# Altium project AUSB.PrjPcb
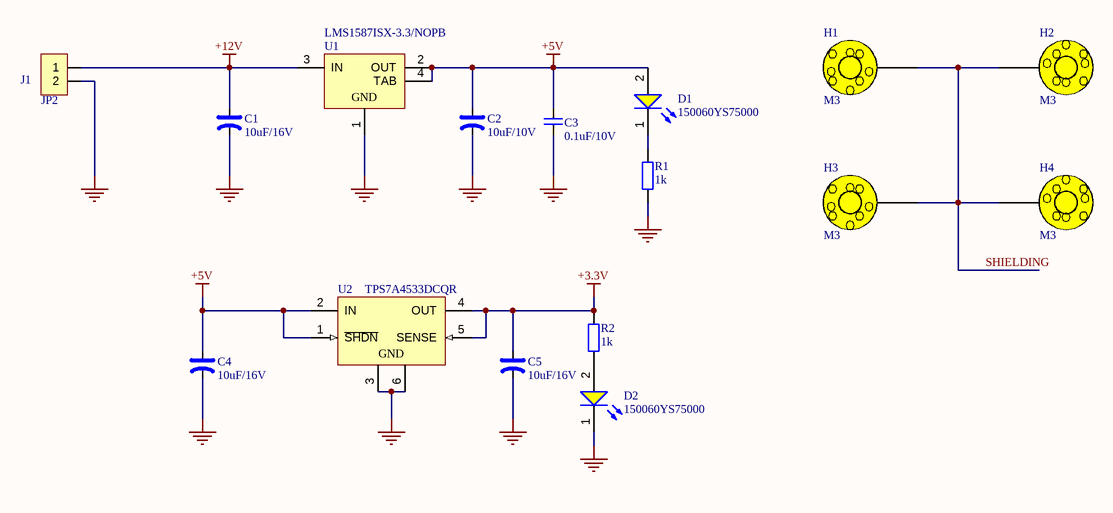
[diagram p0: POWER.SchDoc]
SubSystem: USB board; Revision: 1.0.0; MasterProject: BEEE; DrawnBy: cd; Date: 02/26/2026; CheckedBy: David; ApprovedBy: David
3 sheets, 71 parts. Net scope: global (net labels, ports and power ports of the same name join across sheets).
Board file: AUSB_PCB.PcbDoc
Sheets:
  POWER.SchDoc
  MCU.SchDoc
  AVR.SchDoc

## Sheet POWER.SchDoc
size 420 x 297 mm; SheetNumber: 4; SheetTotal: 7

### Parts
C1  10uF/16V  [CAP_MP_2012X170]
C2  10uF/10V  [CAP_MP_2012X170]
C3  0.1uF/10V  [CAP_C_1608X80]
C4  10uF/16V  [CAP_MP_2012X170]
C5  10uF/16V  [CAP_MP_2012X170]
D1  150060YS75000  [WL-SMCW_0603_150060xx75000]
D2  150060YS75000  [WL-SMCW_0603_150060xx75000]
H1  M3  [HEX-M3]
H2  M3  [HEX-M3]
H3  M3  [HEX-M3]
H4  M3  [HEX-M3]
J1  JP2  [JP2-D1T]
R1  1k  [RES_C_1608X60]
R2  1k  [RES_C_1608X60]
U1  LMS1587ISX-3.3/NOPB  [TS3B_L]
U2  TPS7A4533DCQR  [DCQ0006A_M]

### Nets
+3.3V: C5.1 R2.2 U2.4(OUT) U2.5(SENSE)
+5V: C2.1 C3.1 C4.1 D1.2(A) U1.2(OUT) U1.4(TAB) U2.1(~{SHDN}) U2.2(IN)  [project net NTC1+]
+12V: C1.1 J1.1 U1.3(IN)
GND: C1.2 C2.2 C3.2 C4.2 C5.2 D2.1(K) J1.2 R1.2 U1.1(GND) U2.3(GND) U2.6(GND)
SHIELDING: H1.1 H2.1 H3.1 H4.1
NetD1_1: D1.1(K) R1.1
NetD2_2: D2.2(A) R2.1

### Notes on the sheet
- Sub-system:
- Project:
- Design by:
- Sheet title:
- Sheet
- of
- Checked by:
- Approved by:
- Doc No:
- Revision:
- Size:
- Date:
- A3

### Library data of the parts
C1 C2 C4 C5 = CAP_TH: CAP_Polarization; Published: 8-Jun-2000; LatestRevisionDate: 17-Jul-2002; LatestRevisionNote: Re-released for DXP Platform.; PackageReference: POLAR0.8; Publisher: Altium Limited
C3 = CAP_SMD: CAP_Chip; Value: 33pF
D1 D2 = CMP-1426-00005-2: LED YELLOW CLEAR 0603 SMD; NexarPartId: 29687085; Wavelength: 590nm; Luminous Intensity: 120mcd; Peak Wavelength: 595nm; Forward Current: 100mA; Power Dissipation: 72mW; Forward Voltage: 2V; Test Current: 20mA; Reverse Voltage: 5V; Lens Style: Clear, Rectangular; Max Junction Temperature (Tj): 95°C; Viewing Angle: 140°; Case Code (Imperial): 0603; Height: 700µm; REACH SVHC: Unknown; Dominant Wavelength: 590nm; Min Operating Temperature: -40°C; Color: Yellow; Width: 800µm; Mount: Surface Mount; Packaging: Tape and Reel; Max Operating Temperature: 85°C; RoHS: Compliant; Max Reverse Voltage (DC): 5V; Case Code (Metric): 1608; Length: 1.6mm; Case/Package: 0603
H1-H4 = HEX-M3
J1 = JP2: WR-PHD 2.54 mm Angled Socket Header; Manufacturer: W¨¹rth Elektronik eiSos GmbH; partNo: 613002143121; ComponentLink1 Description: Manufacturer; ComponentLink2 Description: Datasheet; NoPins: 02; Created Date: 29 March 2013; ComponentLink1URL: http://www.we-online.com; ComponentLink2URL: http://katalog.we-online.de/em/datasheet/6130xx143121.pdf; Created by: Karrer Zheng
R1 R2 = Tro 0603 1% 10k: RES; Chung_Loai: Dán; Don_Vi: Con; So_Chan: 2; Ten_Linh_Kien: Trở 0603 1% 10k; Ma_Hang: MH006333; Kieu_Chan: *
U1 = CMP-0062-00180-3: 3A Low Dropout Fast Response Regulators, 3-pin TO-263, Pb-Free; Manufacturer: National Semiconductor; PowerWise: N; High-Reliability: Y; PackageTopMarking: NSUZXYTTE#*LMS1587*IS-3.3; CompType: LDO IC; ComponentLink1Description: Manufacturer URL; PackageReference: TS3B; ComponentLink1URL: http://www.national.com/; ComponentLink2URL: http://www.national.com/ds/LM/LMS1587.pdf; DatasheetVersion: Jun-2005; ComponentLink3URL: http://www.national.com/pf/LM/LMS1587.html; PartNumber: LMS1587ISX-3.3/NOPB; RevisionNote: SCH symbol layout adjusted; PinCount: 3; RoHS: Y; Code_JEDEC: MO-169-AA; PackageDescription: TO-263, Molded, .400 x .390 x .180in, 3 Lead, .1in Pitch, Surface Mount; ComponentLink4Description: TS3B Package Page; ComponentLink3Description: LMS1587 Web Page; PackageVersion: revF, Apr-2005; ComponentLink2Description: LMS1587 Datasheet; ComponentLink4URL: http://www.national.com/packaging/folders/ts3b.html
U2 = CMP-0395-00360-2: Single Output Fast Transient Response LDO, 1.5 A, Fixed 3.3 V Output, 2.1 to 20 V Input, 6-pin SOT-223 (DCQ), -40 to 125 degC, Green (RoHS & no Sb/Br); Manufacturer: Texas Instruments; Vout Adj(Max)(V): 3.3; Vin(Max)(V): 20; Accuracy(%): 1; SubFamily: Single Channel LDO; Vin(Min)(V): 2.1; Iout(Max)(A): 1.5; Vdo(Typ)(mV): 300; Eco-Plan: Green (RoHS & no Sb/Br); Mounting Technology: Surface Mount; PackageDescription: 6-Pin Plastic Small Outline, Body 3.5 x 6.5 mm, Pitch 1.27 mm; ComponentLink2URL: http://www.ti.com/general/docs/lit/getliterature.tsp?genericPartNumber=TPS7A4533&fileType=pdf; PackageReference: DCQ0006A; ComponentLink3Description: Package Specification; ComponentLink2Description: Datasheet; Fixed Output Options(V): 3.3; Iq(Typ)(mA): 1; ComponentLink1URL: http://www.ti.com/; PartNumber: TPS7A4533DCQR; ComponentLink1Description: Manufacturer URL; PackageVersion: 4202109/D; Vout Adj(Min)(V): 3.3; DatasheetVersion: SLVS720D; ComponentLink3URL: http://www.ti.com/litv/pdf/mpds098c

## Sheet MCU.SchDoc
size 420 x 297 mm; SheetNumber: 5; SheetTotal: 7
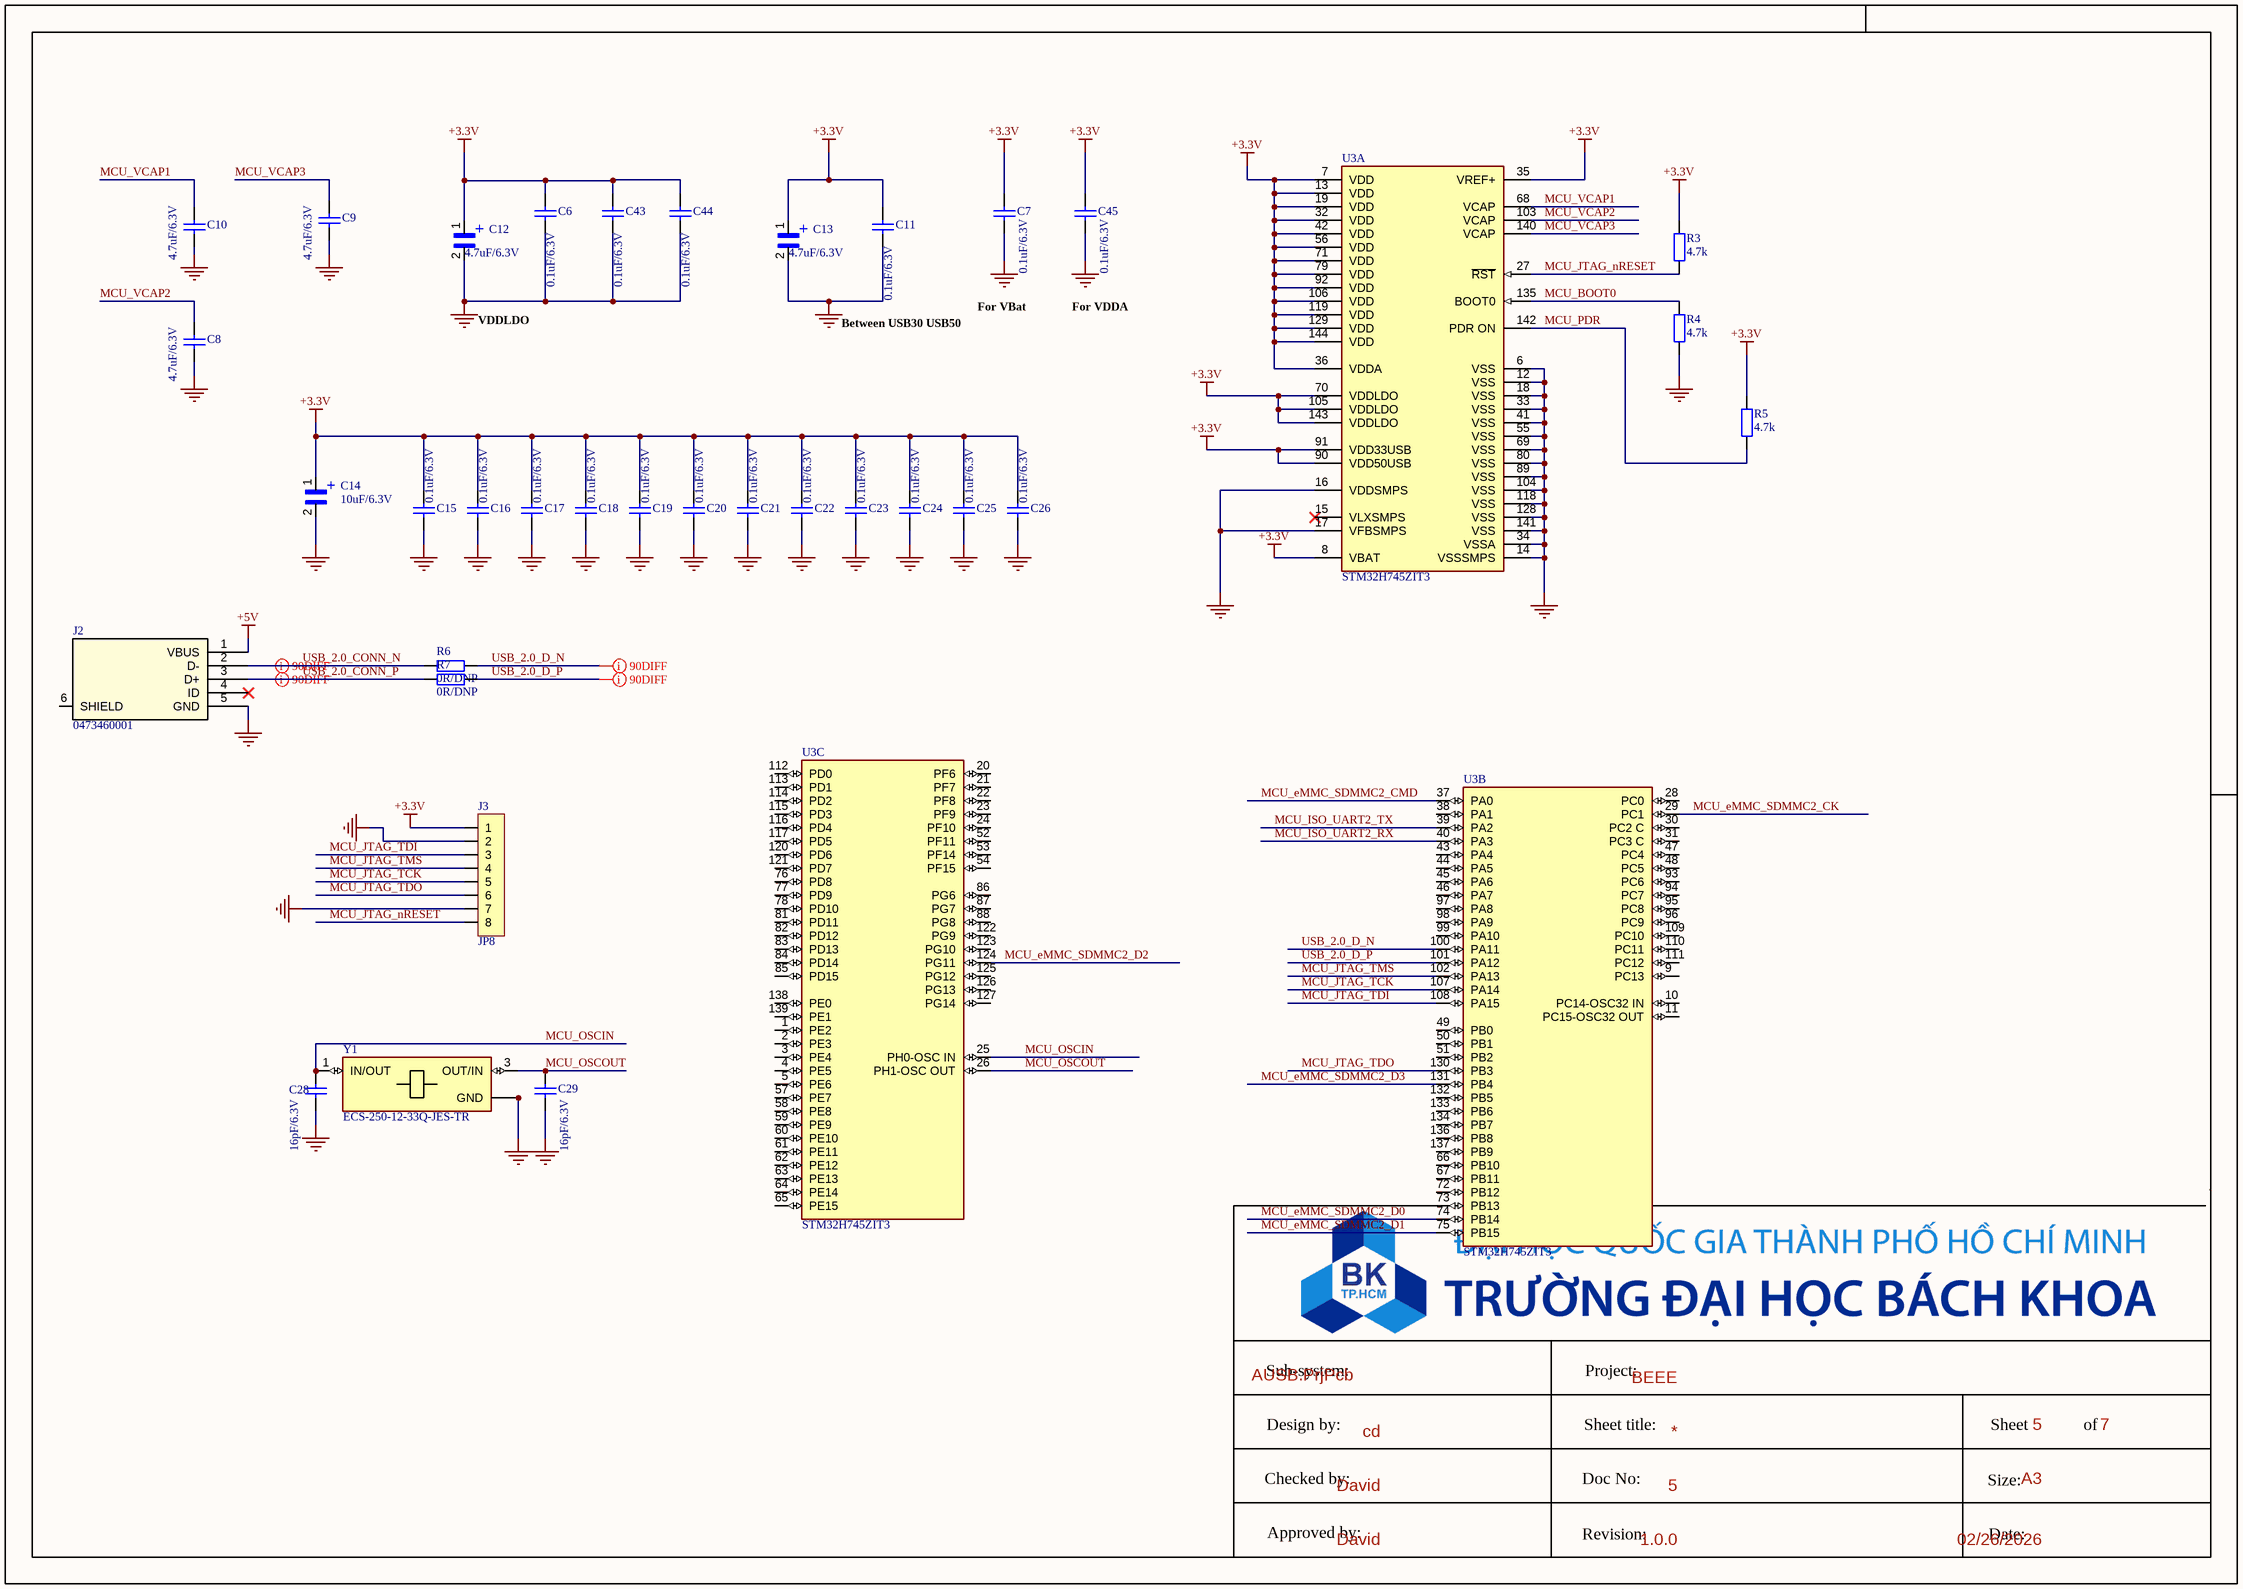
[diagram p1: MCU.SchDoc]

### Parts
C6  0.1uF/6.3V  [CAP_C_1608X80]
C7  0.1uF/6.3V  [CAP_C_1608X80]
C8  4.7uF/6.3V  [CAP_C_1608X80]
C9  4.7uF/6.3V  [CAP_C_1608X80]
C10  4.7uF/6.3V  [CAP_C_1608X80]
C11  0.1uF/6.3V  [CAP_C_1608X80]
C12  4.7uF/6.3V  [CAP_MP_1608X90]
C13  4.7uF/6.3V  [CAP_MP_1608X90]
C14  10uF/6.3V  [CAP_MP_2012X170]
C15  0.1uF/6.3V  [CAP_C_1608X80]
C16  0.1uF/6.3V  [CAP_C_1608X80]
C17  0.1uF/6.3V  [CAP_C_1608X80]
C18  0.1uF/6.3V  [CAP_C_1608X80]
C19  0.1uF/6.3V  [CAP_C_1608X80]
C20  0.1uF/6.3V  [CAP_C_1608X80]
C21  0.1uF/6.3V  [CAP_C_1608X80]
C22  0.1uF/6.3V  [CAP_C_1608X80]
C23  0.1uF/6.3V  [CAP_C_1608X80]
C24  0.1uF/6.3V  [CAP_C_1608X80]
C25  0.1uF/6.3V  [CAP_C_1608X80]
C26  0.1uF/6.3V  [CAP_C_1608X80]
C28  16pF/6.3V  [CAP_C_1608X80]
C29  16pF/6.3V  [CAP_C_1608X80]
C43  0.1uF/6.3V  [CAP_C_1608X80]
C44  0.1uF/6.3V  [CAP_C_1608X80]
C45  0.1uF/6.3V  [CAP_C_1608X80]
J2  0473460001  [47346-0001_MOL]
J3  JP8  [JP8-C1T]
R3  4.7k  [RES_C_1608X60]
R4  4.7k  [RES_C_1608X60]
R5  4.7k  [RES_C_1608X60]
R6  0R/DNP  [RES_C_1608X60]
R7  0R/DNP  [RES_C_1608X60]
U3  STM32H745ZIT3  [FP-LQFP144-1A-MFG]  (parts A,B,C of 3)
Y1  ECS-250-12-33Q-JES-TR  [XTAL_ECS-250-12-33Q-JES-TR]

### Nets
+3.3V: C6.1 C7.1 C11.1 C12.1 C13.1 C14.1 C15.1 C16.1 C17.1 C18.1 C19.1 C20.1 C21.1 C22.1 C23.1 C24.1 C25.1 C26.1 C43.1 C44.1 C45.1 J3.1 R3.1 R5.1 U3.7(VDD) U3.8(VBAT) U3.13(VDD) U3.19(VDD) U3.32(VDD) U3.35(VREF+) U3.36(VDDA) U3.42(VDD) U3.56(VDD) U3.70(VDDLDO) U3.71(VDD) U3.79(VDD) U3.90(VDD50USB) U3.91(VDD33USB) U3.92(VDD) U3.105(VDDLDO) U3.106(VDD) U3.119(VDD) U3.129(VDD) U3.143(VDDLDO) U3.144(VDD)
+5V: J2.1(VBUS)  [project net NTC1+]
GND: C6.2 C7.2 C8.2 C9.2 C10.2 C11.2 C12.2 C13.2 C14.2 C15.2 C16.2 C17.2 C18.2 C19.2 C20.2 C21.2 C22.2 C23.2 C24.2 C25.2 C26.2 C28.1 C29.1 C43.2 C44.2 C45.2 J2.5(GND) J3.2 J3.7 R4.1 U3.6(VSS) U3.12(VSS) U3.14(VSSSMPS) U3.16(VDDSMPS) U3.17(VFBSMPS) U3.18(VSS) U3.33(VSS) U3.34(VSSA) U3.41(VSS) U3.55(VSS) U3.69(VSS) U3.80(VSS) U3.89(VSS) U3.104(VSS) U3.118(VSS) U3.128(VSS) U3.141(VSS) Y1.2(GND) Y1.4(GND)
MCU_BOOT0: R4.2 U3.135(BOOT0)
MCU_eMMC_SDMMC2_CK: U3.29(PC1)
MCU_eMMC_SDMMC2_CMD: U3.37(PA0)
MCU_eMMC_SDMMC2_D0: U3.74(PB14)
MCU_eMMC_SDMMC2_D1: U3.75(PB15)
MCU_eMMC_SDMMC2_D2: U3.124(PG11)
MCU_eMMC_SDMMC2_D3: U3.131(PB4)
MCU_ISO_UART2_RX: U3.40(PA3)
MCU_ISO_UART2_TX: U3.39(PA2)
MCU_JTAG_nRESET: J3.8 R3.2 U3.27(~{RST})
MCU_JTAG_TCK: J3.5 U3.107(PA14)
MCU_JTAG_TDI: J3.3 U3.108(PA15)
MCU_JTAG_TDO: J3.6 U3.130(PB3)
MCU_JTAG_TMS: J3.4 U3.102(PA13)
MCU_OSCIN: C28.2 U3.25(PH0-OSC_IN) Y1.1(IN/OUT)
MCU_OSCOUT: C29.2 U3.26(PH1-OSC_OUT) Y1.3(OUT/IN)
MCU_PDR: R5.2 U3.142(PDR_ON)
MCU_VCAP1: C10.1 U3.68(VCAP)
MCU_VCAP2: C8.1 U3.103(VCAP)
MCU_VCAP3: C9.1 U3.140(VCAP)
USB_2.0_CONN_N: J2.2(D-) R6.1
USB_2.0_CONN_P: J2.3(D+) R7.1
USB_2.0_D_N: R6.2 U3.100(PA11)
USB_2.0_D_P: R7.2 U3.101(PA12)

Not connected (* = marked no-connect by the designer): J2 4(ID)* 6(SHIELD); U3 1(PE2) 2(PE3) 3(PE4) 4(PE5) 5(PE6) 9(PC13) 10(PC14-OSC32_IN) 11(PC15-OSC32_OUT) 15(VLXSMPS)* 20(PF6) 21(PF7) 22(PF8) 23(PF9) 24(PF10) 28(PC0) 30(PC2_C) 31(PC3_C) 38(PA1) 43(PA4) 44(PA5) 45(PA6) 46(PA7) 47(PC4) 48(PC5) 49(PB0) 50(PB1) 51(PB2) 52(PF11) 53(PF14) 54(PF15) 57(PE7) 58(PE8) 59(PE9) 60(PE10) 61(PE11) 62(PE12) 63(PE13) 64(PE14) 65(PE15) 66(PB10) 67(PB11) 72(PB12) 73(PB13) 76(PD8) 77(PD9) 78(PD10) 81(PD11) 82(PD12) 83(PD13) 84(PD14) 85(PD15) 86(PG6) 87(PG7) 88(PG8) 93(PC6) 94(PC7) 95(PC8) 96(PC9) 97(PA8) 98(PA9) 99(PA10) 109(PC10) 110(PC11) 111(PC12) 112(PD0) 113(PD1) 114(PD2) 115(PD3) 116(PD4) 117(PD5) 120(PD6) 121(PD7) 122(PG9) 123(PG10) 125(PG12) 126(PG13) 127(PG14) 132(PB5) 133(PB6) 134(PB7) 136(PB8) 137(PB9) 138(PE0) 139(PE1)

### Layout directives
differential pair; differential pair class DIFF90: USB_2.0_CONN_N, USB_2.0_CONN_P, USB_2.0_D_N, USB_2.0_D_P

### Notes on the sheet
- VDDLDO
- Between USB30 USB50
- For VBat
- For VDDA
- Sub-system:
- Project:
- Design by:
- Sheet title:
- Sheet
- of
- Checked by:
- Approved by:
- Doc No:
- Revision:
- Size:
- Date:
- A3
- (in symbol TACL335M003RTA) +
- (in symbol TACR686M003RTA) +

### Library data of the parts
C6 C8-C10 C43 C44 = Tu 0402 33nF 10V: 4.7 µF ±20% 6.3V Ceramic Capacitor X7T 0402 (1005 Metric): GRT155D70J475ME13J; Chung_Loai: Dán; Don_Vi: Con; So_Chan: 2; Ten_Linh_Kien: Tụ 0402 33nF X7R 10V GRM155R71A333KA01D; Ma_Hang: MH007853; Kieu_Chan: *
C7 C11 C15-C26 C28 C29 C45 = Tu 0402 33nF 10V: CAPC; Chung_Loai: Dán; Don_Vi: Con; So_Chan: 2; Ten_Linh_Kien: Tụ 0402 33nF X7R 10V GRM155R71A333KA01D; Ma_Hang: MH007853; Kieu_Chan: *
C12 C13 = TACL335M003RTA: CAPP; Package: None; Price: None; Value: *; MP: TACL335M003RTA; Availability: Unavailable
C14 = TACR686M003RTA: CAPP; MF: AVX; Availability: Unavailable; SnapEDA_Link: https://www.snapeda.com/parts/TACR686M003RTA/AVX/view-part/1745975/?ref=snap; MP: TACR686M003RTA; Value: *; Price: None; Package: 0805 AVX
J2 = USB_micro: No Description Available; Mfr_Name: Molex Connector Corporation; RefDes: RefDes; Type: Type
R3-R5 = Tro 0603 1% 10k: as R1 on sheet POWER; Kieu_Chan: *
R6 R7 = Tro 0603 1% 1k: RES SMD 12K OHM 1% 1/10W 0603, P/N: ERJ-3EKF1202V; Chung_Loai: Dán; So_Chan: 2; Don_Vi: Con; Ten_Linh_Kien: Trở 0603 1% 1k; Ma_Hang: MH006334; Kieu_Chan: *
U3 = CMP-12105-000054-1: HIGH-PERFORMANCE AND DSP WITH DP; Manufacturer Part Number: STM32H745ZIT6; Manufacturer: STMicroelectronics; Number Of Timers/Counters: 20; Min Supply Voltage: 1.62V; Frequency: 480MHz; Number Of I2C Channels: 4; Memory Type: FLASH; Number Of I/Os: 97; Number Of Pwm Channels: 42; Number Of Usb Channels: 2; Ram Size: 1MBytes; Memory Size: 2MBytes; Data Bus Width: 32bits; Number Of Adc Channels: 23; Number Of Ethernet Channels: 1; Number Of Uart Channels: 9; Interface: I2C,SPI,UART,USART,CAN,USB,LIN,IrDA,Ethernet,I2S,Other; Number Of A/D Converters: 3; Max Junction Temp: +125°C; Max Supply Voltage: 3.6V; Core Architecture: ARM Cortex-M4, Cortex-M7; Number Of Spi Channels: 6; Standoff Height: 0.05mm; Ambient Temperature Range Low: -40°C; Lead Free: Yes; Automotive: No; Height: 1.6mm; Device Class L1: Integrated Circuits (ICs); Ambient Temperature Range High: +85°C; RoHS: TRUE; Temperature Range High: +125°C; Temperature: -40°C to +125°C; Category: IC; Device Class L2: Embedded Processors and Controllers; Number Of Cores: 2; Temperature Range Low: -40°C; Octopart: https://octopart.com/stm32h745zit6-stmicroelectronics-100293939; Digikey Description: HIGH-PERFORMANCE AND DSP WITH DP; Package: LQFP144-1A; Device Class L3: Microcontrollers; ComponentLink2URL: https://www.st.com/resource/en/datasheet/stm32h745zi.pdf; ComponentLink2Description: Datasheet
Y1 = ECS-250-12-33Q-JES-TR: 25 MHz Â±20ppm Crystal 12pF 40 Ohms 4-SMD, No Lead; MF: ECS Inc.; Value: *; Purchase-URL: https://pricing.snapeda.com/search/part/ECS-250-12-33Q-JES-TR/?ref=eda; Package: ECS-33B ECS Inc.; Availability: In Stock; SnapEDA_Link: https://www.snapeda.com/parts/ECS-250-12-33Q-JES-TR/ECS+Inc./view-part/?ref=snap; MP: ECS-250-12-33Q-JES-TR; Check_prices: https://www.snapeda.com/parts/ECS-250-12-33Q-JES-TR/ECS+Inc./view-part/?ref=eda; Price: None

## Sheet AVR.SchDoc
size 420 x 297 mm; SheetNumber: 7; SheetTotal: 7
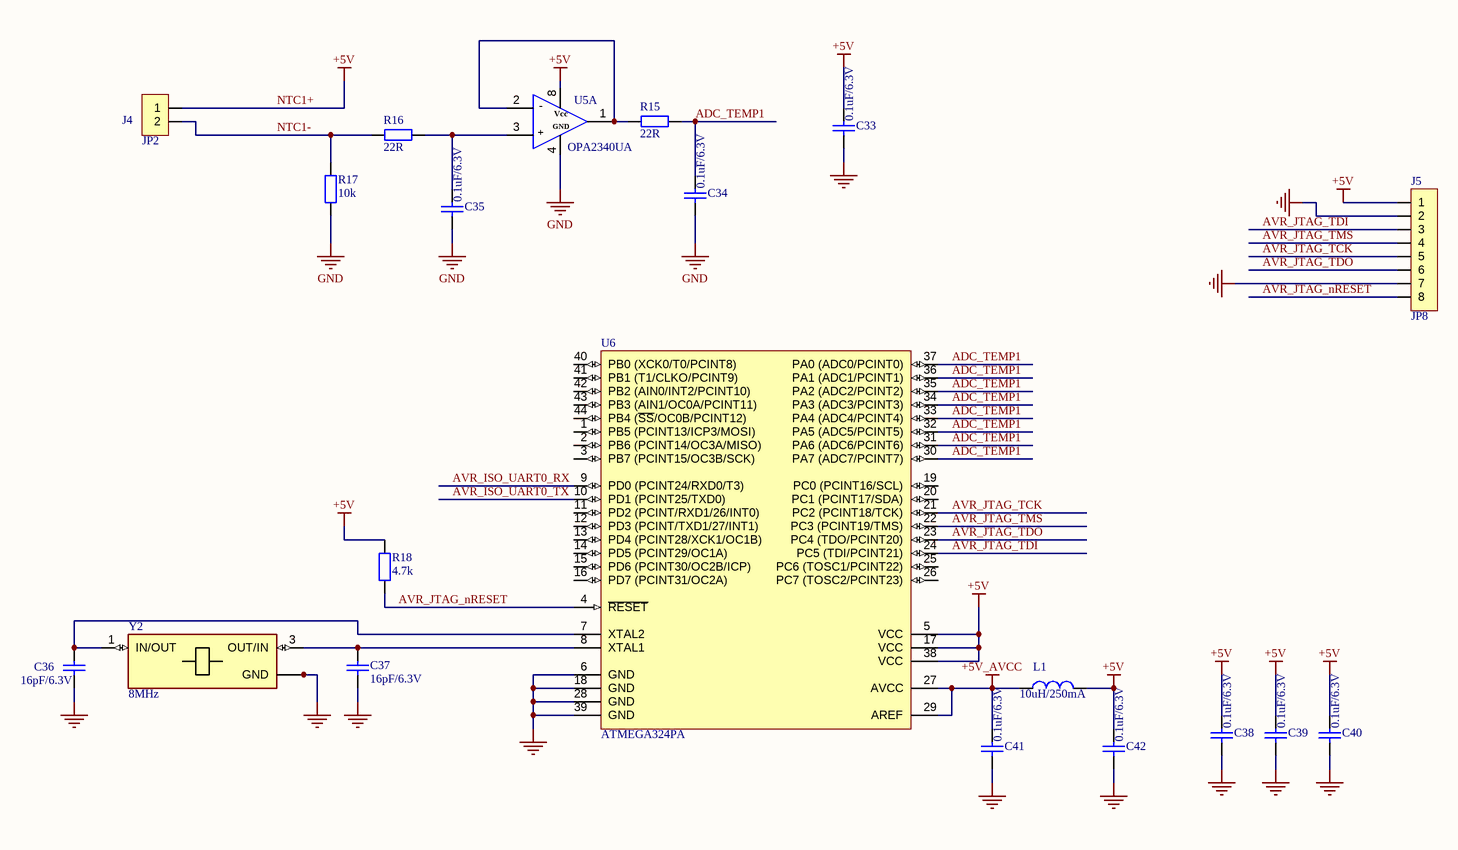
[diagram p2: AVR.SchDoc]

### Parts
C33  0.1uF/6.3V  [CAP_C_1608X80]
C34  0.1uF/6.3V  [CAP_C_1608X80]
C35  0.1uF/6.3V  [CAP_C_1608X80]
C36  16pF/6.3V  [CAP_C_1608X80]
C37  16pF/6.3V  [CAP_C_1608X80]
C38  0.1uF/6.3V  [CAP_C_1608X80]
C39  0.1uF/6.3V  [CAP_C_1608X80]
C40  0.1uF/6.3V  [CAP_C_1608X80]
C41  0.1uF/6.3V  [CAP_C_1608X80]
C42  0.1uF/6.3V  [CAP_C_1608X80]
J4  JP2  [JP2-D1T]
J5  JP8  [JP8-C1T]
L1  10uH/250mA  [RES_C_1608X60]
R15  22R  [RES_C_1608X60]
R16  22R  [RES_C_1608X60]
R17  10k  [RES_C_1608X60]
R18  4.7k  [RES_C_1608X60]
U5  OPA2340UA  [SOIC127P602X173-8N]  (part A of 2)
U6  ATMEGA324PA  [QFP80P1200X1200X120-44]
Y2  8MHz  [XTAL_ECS-250-12-33Q-JES-TR]

### Nets
+5V_AVCC: C41.1 L1.1 U6.27(AVCC) U6.29(AREF)
GND: C33.2 C34.2 C35.2 C36.1 C37.1 C38.2 C39.2 C40.2 C41.2 C42.2 J5.2 J5.7 R17.2 U5.4 U6.6(GND) U6.18(GND) U6.28(GND) U6.39(GND) Y2.2(GND) Y2.4(GND)
NTC1+: C33.1 C38.1 C39.1 C40.1 C42.1 J4.1 J5.1 L1.2 R18.2 U5.8 U6.5(VCC) U6.17(VCC) U6.38(VCC)  [also labelled +5V]
ADC_TEMP1: C34.1 R15.1 U6.30(PA7_(ADC7/PCINT7)) U6.31(PA6_(ADC6/PCINT6)) U6.32(PA5_(ADC5/PCINT5)) U6.33(PA4_(ADC4/PCINT4)) U6.34(PA3_(ADC3/PCINT3)) U6.35(PA2_(ADC2/PCINT2)) U6.36(PA1_(ADC1/PCINT1)) U6.37(PA0_(ADC0/PCINT0))
AVR_ISO_UART0_RX: U6.9(PD0_(PCINT24/RXD0/T3))
AVR_ISO_UART0_TX: U6.10(PD1_(PCINT25/TXD0))
AVR_JTAG_nRESET: J5.8 R18.1 U6.4(~{RESET})
AVR_JTAG_TCK: J5.5 U6.21(PC2_(PCINT18/TCK))
AVR_JTAG_TDI: J5.3 U6.24(PC5_(TDI/PCINT21))
AVR_JTAG_TDO: J5.6 U6.23(PC4_(TDO/PCINT20))
AVR_JTAG_TMS: J5.4 U6.22(PC3_(PCINT19/TMS))
NTC1-: J4.2 R16.2 R17.1
NetC35_1: C35.1 R16.1 U5.3
NetC36_2: C36.2 U6.7(XTAL2) Y2.1(IN/OUT)
NetC37_2: C37.2 U6.8(XTAL1) Y2.3(OUT/IN)
NetR15_2: R15.2 U5.1 U5.2

Not connected (* = marked no-connect by the designer): U6 1(PB5_(PCINT13/ICP3/MOSI)) 2(PB6_(PCINT14/OC3A/MISO)) 3(PB7_(PCINT15/OC3B/SCK)) 11(PD2_(PCINT/RXD1/26/INT0)) 12(PD3_(PCINT/TXD1/27/INT1)) 13(PD4_(PCINT28/XCK1/OC1B)) 14(PD5_(PCINT29/OC1A)) 15(PD6_(PCINT30/OC2B/ICP)) 16(PD7_(PCINT31/OC2A)) 19(PC0_(PCINT16/SCL)) 20(PC1_(PCINT17/SDA)) 25(PC6_(TOSC1/PCINT22)) 26(PC7_(TOSC2/PCINT23)) 40(PB0_(XCK0/T0/PCINT8)) 41(PB1_(T1/CLKO/PCINT9)) 42(PB2_(AIN0/INT2/PCINT10)) 43(PB3_(AIN1/OC0A/PCINT11)) 44(PB4_(~{SS}/OC0B/PCINT12))

### Notes on the sheet
- Sub-system:
- Project:
- Design by:
- Sheet title:
- Sheet
- of
- Checked by:
- Approved by:
- Doc No:
- Revision:
- Size:
- Date:
- A3
- (in symbol OPA2340UA/2K5, part A) -; Vcc; GND; +

### Library data of the parts
C33-C42 = Tu 0402 33nF 10V: as C7 on sheet MCU; Kieu_Chan: *
J4 = JP2: as J1 on sheet POWER; Created Date: 29 March 2013; ComponentLink1URL: http://www.we-online.com; ComponentLink2URL: http://katalog.we-online.de/em/datasheet/6130xx143121.pdf; Created by: Karrer Zheng
L1 = L-SMD-1: partNo: 78477010; Manufacturer: Wurth Elektronik; Inductance: 1.0 μH; ComponentLink1Description: Manufacturer; ComponentLink1URL: http://www.we-online.de; Created by: Baojun Chen; Created Date: Nov.2015; ComponentLink2Description: Datasheet; ComponentLink2URL: http://katalog.we-online.de/pbs/datasheet/78477010.pdf
R15-R18 = Tro 0603 1% 10k: as R1 on sheet POWER; Kieu_Chan: *
U5 = OPA2340UA/2K5
U6 = MCU_ATMEGA324PA
Y2 = ECS-250-12-33Q-JES-TR: as Y1 on sheet MCU; Value: *; Purchase-URL: https://pricing.snapeda.com/search/part/ECS-250-12-33Q-JES-TR/?ref=eda; Package: ECS-33B ECS Inc.; Availability: In Stock; SnapEDA_Link: https://www.snapeda.com/parts/ECS-250-12-33Q-JES-TR/ECS+Inc./view-part/?ref=snap; MP: ECS-250-12-33Q-JES-TR; Check_prices: https://www.snapeda.com/parts/ECS-250-12-33Q-JES-TR/ECS+Inc./view-part/?ref=eda; Price: None

## Nets that join several sheets
+3.3V: POWER (C5.1 R2.2 U2.4 U2.5), MCU (45 pins)
GND: POWER (11 pins), MCU (49 pins), AVR (20 pins)
NTC1+: POWER (8 pins), MCU (J2.1), AVR (13 pins)